# Altium schematic sheet main.SchDoc
size A3; SheetNumber: 1; SheetTotal: 4
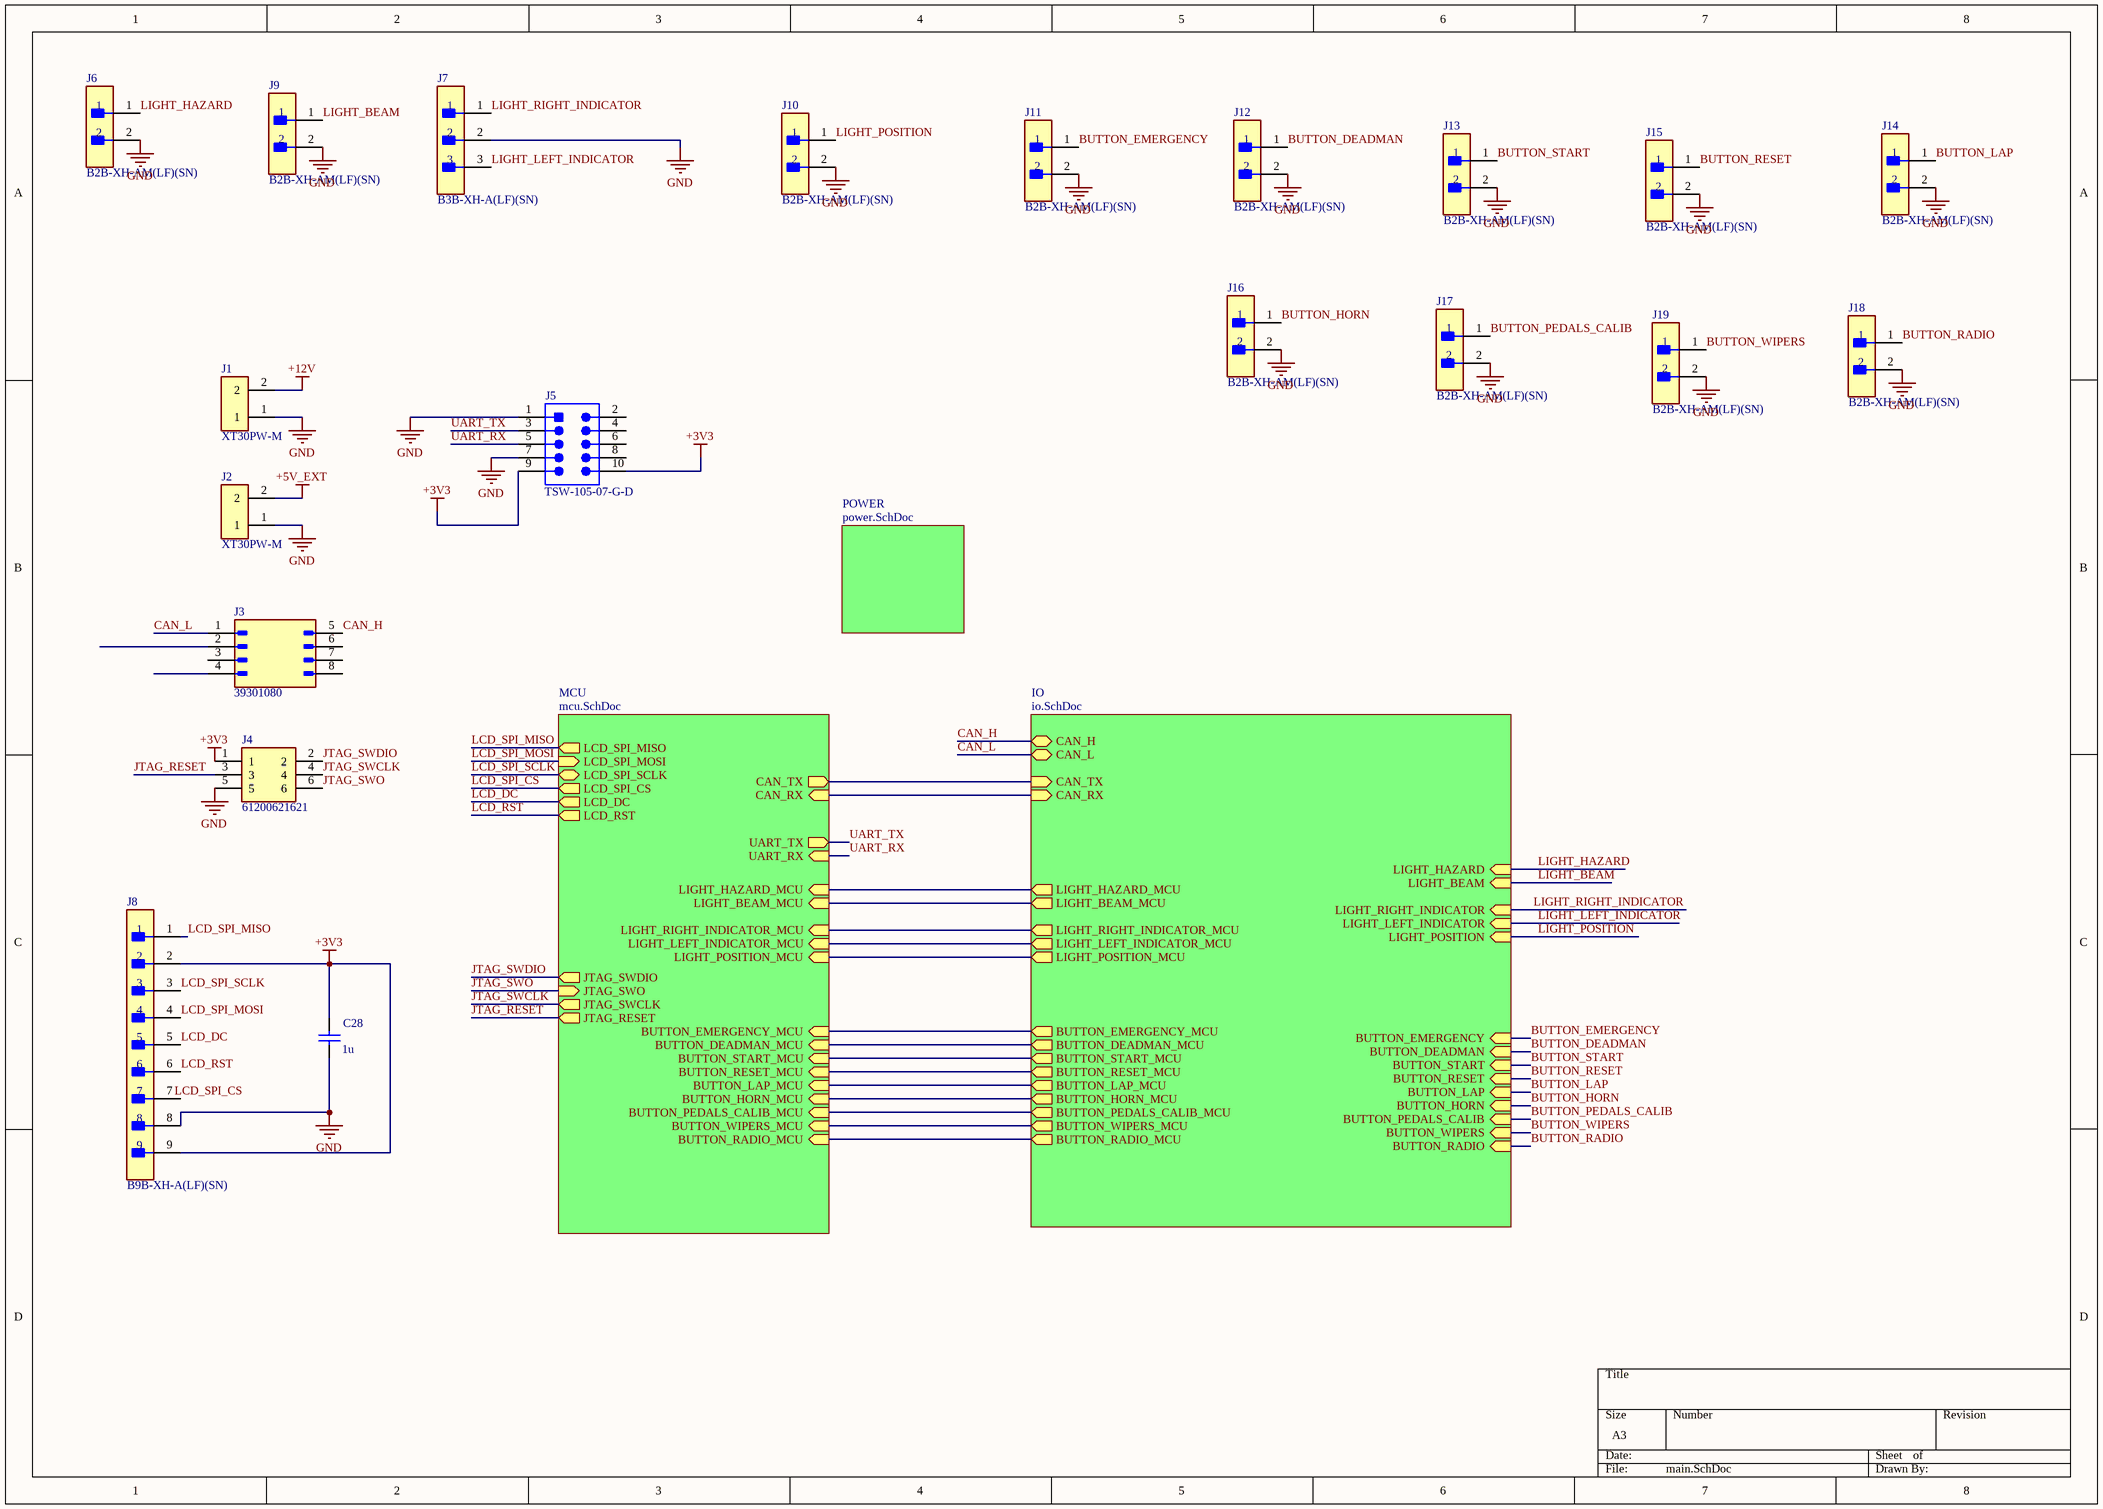
[diagram p0: main.SchDoc]

## Parts
C28  1u  [CAPC1206(3216)150_L]
J1  XT30PW-M  [XT30PWM]
J2  XT30PW-M  [XT30PWM]
J3  39301080  [39301080]
J4  61200621621  [61200621621]
J5  TSW-105-07-G-D  [SMTC-TSW-105-07-G-D_V]
J6  B2B-XH-AM(LF)(SN)  [FP-B2B-XH-AM_LF_SN-MFG]
J7  B3B-XH-A(LF)(SN)  [FP-B3B-XH-A_LF_SN-MFG]
J8  B9B-XH-A(LF)(SN)  [FP-B9B-XH-A_LF_SN-MFG]
J9  B2B-XH-AM(LF)(SN)  [FP-B2B-XH-AM_LF_SN-MFG]
J10  B2B-XH-AM(LF)(SN)  [FP-B2B-XH-AM_LF_SN-MFG]
J11  B2B-XH-AM(LF)(SN)  [FP-B2B-XH-AM_LF_SN-MFG]
J12  B2B-XH-AM(LF)(SN)  [FP-B2B-XH-AM_LF_SN-MFG]
J13  B2B-XH-AM(LF)(SN)  [FP-B2B-XH-AM_LF_SN-MFG]
J14  B2B-XH-AM(LF)(SN)  [FP-B2B-XH-AM_LF_SN-MFG]
J15  B2B-XH-AM(LF)(SN)  [FP-B2B-XH-AM_LF_SN-MFG]
J16  B2B-XH-AM(LF)(SN)  [FP-B2B-XH-AM_LF_SN-MFG]
J17  B2B-XH-AM(LF)(SN)  [FP-B2B-XH-AM_LF_SN-MFG]
J18  B2B-XH-AM(LF)(SN)  [FP-B2B-XH-AM_LF_SN-MFG]
J19  B2B-XH-AM(LF)(SN)  [FP-B2B-XH-AM_LF_SN-MFG]

## Sub-sheets
IO = io.SchDoc: CAN_TX (in), CAN_RX (in), CAN_H (bidir), CAN_L (bidir), LIGHT_HAZARD_MCU (out), LIGHT_BEAM_MCU (out), LIGHT_RIGHT_INDICATOR_MCU (out), LIGHT_LEFT_INDICATOR_MCU (out), LIGHT_POSITION_MCU (out), LIGHT_HAZARD (in), LIGHT_BEAM (in), LIGHT_RIGHT_INDICATOR (in), LIGHT_LEFT_INDICATOR (in), LIGHT_POSITION (in), BUTTON_EMERGENCY_MCU (out), BUTTON_DEADMAN_MCU (out), BUTTON_START_MCU (out), BUTTON_RESET_MCU (out), BUTTON_LAP_MCU (out), BUTTON_HORN_MCU (out), BUTTON_PEDALS_CALIB_MCU (out), BUTTON_WIPERS_MCU (out), BUTTON_RADIO_MCU (out), BUTTON_EMERGENCY (in), BUTTON_DEADMAN (in), BUTTON_START (in), BUTTON_RESET (in), BUTTON_LAP (in), BUTTON_HORN (in), BUTTON_PEDALS_CALIB (in), BUTTON_WIPERS (in), BUTTON_RADIO (in)
MCU = mcu.SchDoc: CAN_TX (out), CAN_RX (in), UART_TX (out), UART_RX (in), JTAG_SWDIO (out), JTAG_SWO (in), JTAG_SWCLK (out), JTAG_RESET (out), LCD_SPI_MISO (out), LCD_SPI_MOSI (in), LCD_SPI_SCLK (bidir), LCD_SPI_CS (out), LCD_DC (out), LCD_RST (out), LIGHT_HAZARD_MCU (in), LIGHT_BEAM_MCU (in), LIGHT_RIGHT_INDICATOR_MCU (in), LIGHT_LEFT_INDICATOR_MCU (in), LIGHT_POSITION_MCU (in), BUTTON_EMERGENCY_MCU (in), BUTTON_DEADMAN_MCU (in), BUTTON_START_MCU (in), BUTTON_RESET_MCU (in), BUTTON_LAP_MCU (in), BUTTON_HORN_MCU (in), BUTTON_PEDALS_CALIB_MCU (in), BUTTON_WIPERS_MCU (in), BUTTON_RADIO_MCU (in)
POWER = power.SchDoc: no entries

## Nets
+3V3: C28.1 J4.1 J5.9 J5.10 J8.2 J8.9
+5V_EXT: J2.2
+12V: J1.2
GND: C28.2 J1.1 J2.1 J4.5 J5.1 J5.7 J6.2 J7.2 J8.8 J9.2 J10.2 J11.2 J12.2 J13.2 J14.2 J15.2 J16.2 J17.2 J18.2 J19.2
BUTTON_DEADMAN: J12.1 ; sheet IO/BUTTON_DEADMAN
BUTTON_EMERGENCY: J11.1 ; sheet IO/BUTTON_EMERGENCY
BUTTON_HORN: J16.1 ; sheet IO/BUTTON_HORN
BUTTON_LAP: J14.1 ; sheet IO/BUTTON_LAP
BUTTON_PEDALS_CALIB: J17.1 ; sheet IO/BUTTON_PEDALS_CALIB
BUTTON_RADIO: J18.1 ; sheet IO/BUTTON_RADIO
BUTTON_RESET: J15.1 ; sheet IO/BUTTON_RESET
BUTTON_START: J13.1 ; sheet IO/BUTTON_START
BUTTON_WIPERS: J19.1 ; sheet IO/BUTTON_WIPERS
CAN_H: J3.5 ; sheet IO/CAN_H
CAN_L: J3.1 ; sheet IO/CAN_L
JTAG_RESET: J4.3 ; sheet MCU/JTAG_RESET
JTAG_SWCLK: J4.4 ; sheet MCU/JTAG_SWCLK
JTAG_SWDIO: J4.2 ; sheet MCU/JTAG_SWDIO
JTAG_SWO: J4.6 ; sheet MCU/JTAG_SWO
LCD_DC: J8.5 ; sheet MCU/LCD_DC
LCD_RST: J8.6 ; sheet MCU/LCD_RST
LCD_SPI_CS: sheet MCU/LCD_SPI_CS
LCD_SPI_MISO: J8.1 ; sheet MCU/LCD_SPI_MISO
LCD_SPI_MOSI: J8.4 ; sheet MCU/LCD_SPI_MOSI
LCD_SPI_SCLK: J8.3 ; sheet MCU/LCD_SPI_SCLK
LIGHT_BEAM: J9.1 ; sheet IO/LIGHT_BEAM
LIGHT_HAZARD: J6.1 ; sheet IO/LIGHT_HAZARD
LIGHT_LEFT_INDICATOR: J7.3 ; sheet IO/LIGHT_LEFT_INDICATOR
LIGHT_POSITION: J10.1 ; sheet IO/LIGHT_POSITION
LIGHT_RIGHT_INDICATOR: J7.1 ; sheet IO/LIGHT_RIGHT_INDICATOR
UART_RX: J5.5 ; sheet MCU/UART_RX
UART_TX: J5.3 ; sheet MCU/UART_TX
(unnamed): sheet MCU/CAN_TX, sheet IO/CAN_TX
(unnamed): sheet MCU/CAN_RX, sheet IO/CAN_RX
(unnamed): sheet MCU/LIGHT_HAZARD_MCU, sheet IO/LIGHT_HAZARD_MCU
(unnamed): sheet MCU/LIGHT_BEAM_MCU, sheet IO/LIGHT_BEAM_MCU
(unnamed): sheet MCU/LIGHT_RIGHT_INDICATOR_MCU, sheet IO/LIGHT_RIGHT_INDICATOR_MCU
(unnamed): sheet MCU/LIGHT_LEFT_INDICATOR_MCU, sheet IO/LIGHT_LEFT_INDICATOR_MCU
(unnamed): sheet MCU/LIGHT_POSITION_MCU, sheet IO/LIGHT_POSITION_MCU
(unnamed): sheet MCU/BUTTON_EMERGENCY_MCU, sheet IO/BUTTON_EMERGENCY_MCU
(unnamed): sheet MCU/BUTTON_DEADMAN_MCU, sheet IO/BUTTON_DEADMAN_MCU
(unnamed): sheet MCU/BUTTON_START_MCU, sheet IO/BUTTON_START_MCU
(unnamed): sheet MCU/BUTTON_RESET_MCU, sheet IO/BUTTON_RESET_MCU
(unnamed): sheet MCU/BUTTON_LAP_MCU, sheet IO/BUTTON_LAP_MCU
(unnamed): sheet MCU/BUTTON_HORN_MCU, sheet IO/BUTTON_HORN_MCU
(unnamed): sheet MCU/BUTTON_PEDALS_CALIB_MCU, sheet IO/BUTTON_PEDALS_CALIB_MCU
(unnamed): sheet MCU/BUTTON_WIPERS_MCU, sheet IO/BUTTON_WIPERS_MCU
(unnamed): sheet MCU/BUTTON_RADIO_MCU, sheet IO/BUTTON_RADIO_MCU

Not connected (* = marked no-connect by the designer): J3 2 3 4 6 7 8; J5 2 4 6 8; J8 7

## Notes on the sheet
- Labels drawn without touching a wire or pin: LCD_SPI_CS

## Library data of the parts
C28 = CMP-1037-04778-1: CAP 1.8uF 10V ±5% 1206 (3216 Metric) Thickness 1.45mm SMD; Case-EIA: 1206; Tolerance: Â±5%; Case-Metric: 3216; Technology: SMT; Value: 1.8uF; Rated Voltage: 10 V; Max Thickness: 1.45 mm
J1 J2 = XT30PW-M: Plug; XT30; Male; 30A; Low Temperature Rise Fire Retardant; Manufacturer_Name: Amass; Geometry.Height: 5mm; Manufacturer_Part_Number: XT30PW-M; Mouser Part Number: *; Mouser Price/Stock: *; Arrow Part Number: *; Arrow Price/Stock: *; Datasheet Link: https://www.tme.eu/sl/Document/ce4077e36b79046da520ca73227e15de/XT30PW%20SPEC.pdf; ComponentLink1URL: https://datasheet.octopart.com/XT30PW-M-Amass-datasheet-165556440.pdf?src-supplier=TME; ComponentLink1Description: https://datasheet.octopart.com/XT30PW-M-Amass-datasheet-165556440.pdf?src-supplier=TME
J3 = 39301080: Connector Wire to Board Header 8 Position 4.2mm Solder Right Angle Thru-Hole Tray; Manufacturer Lifecycle Status: ACTIVE; MF: Molex; Approvals: CSA, TUV, UL; Connector Type: Power, Rectangular; Contact Resistance: 10mΩ; Current Rating: 8A; Gender: Male; Glow Wire Compliant: Non-compliant; Insulation Resistance: 1GΩ; Max Current Rating: 5A; Max Voltage Rating (DC): 250V; Number of Circuits: 6; Number of Contacts: 8; Plating Thickness: 2.54µm; Voltage Rating: 600V; SnapEDA_Link: https://www.snapeda.com/parts/39-30-1080/Molex/view-part/?ref=snap; Package: None; Value: *; MP: 39-30-1080; Check_prices: https://www.snapeda.com/parts/39-30-1080/Molex/view-part/?ref=eda; Supplier: RS; Supplier Part Number: 5109865P; Manufacturer: Molex; Manufacturer Part Number: 39-30-1080; RoHS: Compliant; Category: Headers and Wire Housings; Stock: 1025; China RoHS: Compliant; Color: Natural; Contact Gender: Male; Contact Material: Brass; Contact Plating: Tin; Country of Origin: US; Depth: 5.57mm; ELV: Compliant; Flammability Rating: UL94 V-2; Halogen Free: Low Halogen; Height: 9.9mm; Housing Material: Nylon; Lead Free: Lead Free; Lead Pitch: 4.2mm; Length: 15.65mm; Lifecycle Status: Production; Material: Nylon; Max Operating Temperature: 105°C; Min Operating Temperature: -40°C; Mounting Technology: PCB, Through Hole; Pins: 8; Number of Poles: 8; Number of Positions: 8; Number of Rows: 2; Orientation: Right Angle; Packaging: Bulk; Pitch: 4.2mm; Radiation Hardening: No; REACH SVHC: Yes; Row Spacing: 4.2mm; Schedule B: 8536694040, 8536694040|8536694040|8536694040|8536694040|8536694040; Termination: Solder; Voltage Rating (AC): 600V; Voltage Rating (DC): 600V; Working Voltage: 600V; ComponentLink1URL: https://datasheet.octopart.com:443/39-30-1080-Molex-datasheet-120074128.pdf?src-supplier=IHS; ComponentLink1Description: https://datasheet.octopart.com:443/39-30-1080-Molex-datasheet-120074128.pdf?src-supplier=IHS; ComponentLink2URL: https://datasheet.octopart.com:443/39-30-1080-Molex-datasheet-13785313.pdf?src-supplier=Sager+Electronics; ComponentLink2Description: https://datasheet.octopart.com:443/39-30-1080-Molex-datasheet-13785313.pdf?src-supplier=Sager+Electronics; ComponentLink3URL: https://sigma.octopart.com:443/15644801/technical_drawing/Molex-39-30-1080.pdf?src-supplier=Molex; ComponentLink3Description: https://sigma.octopart.com:443/15644801/technical_drawing/Molex-39-30-1080.pdf?src-supplier=Molex; ComponentLink4URL: https://datasheet.octopart.com:443/39-30-1080-Molex-datasheet-12555477.pdf?src-supplier=Molex; ComponentLink4Description: https://datasheet.octopart.com:443/39-30-1080-Molex-datasheet-12555477.pdf?src-supplier=Molex; ComponentLink5URL: https://datasheet.octopart.com:443/039301080-Molex-datasheet-8338717.pdf?src-supplier=Future+Electronics; ComponentLink5Description: https://datasheet.octopart.com:443/039301080-Molex-datasheet-8338717.pdf?src-supplier=Future+Electronics; ComponentLink6URL: https://datasheet.octopart.com:443/39301080-Molex-datasheet-137316104.pdf?src-supplier=Future+Electronics; ComponentLink6Description: https://datasheet.octopart.com:443/39301080-Molex-datasheet-137316104.pdf?src-supplier=Future+Electronics; ComponentLink7URL: https://datasheet.octopart.com:443/39-30-1080-Molex-datasheet-154749340.pdf?src-supplier=Master+Electronics; ComponentLink7Description: https://datasheet.octopart.com:443/39-30-1080-Molex-datasheet-154749340.pdf?src-supplier=Master+Electronics; ComponentLink8URL: https://datasheet.octopart.com:443/39-30-1080-Molex-datasheet-101582412.pdf?src-supplier=Farnell; ComponentLink8Description: https://datasheet.octopart.com:443/39-30-1080-Molex-datasheet-101582412.pdf?src-supplier=Farnell; ComponentLink9URL: https://datasheet.octopart.com:443/39-30-1080-Molex-datasheet-15687899.pdf?src-supplier=Farnell; ComponentLink9Description: https://datasheet.octopart.com:443/39-30-1080-Molex-datasheet-15687899.pdf?src-supplier=Farnell; ComponentLink10URL: https://datasheet.octopart.com:443/39-30-1080-Molex-datasheet-13550729.pdf?src-supplier=Farnell; ComponentLink10Description: https://datasheet.octopart.com:443/39-30-1080-Molex-datasheet-13550729.pdf?src-supplier=Farnell; ComponentLink11URL: https://datasheet.octopart.com:443/39-30-1080-Molex-datasheet-34223370.pdf?src-supplier=Electro+Sonic; ComponentLink11Description: https://datasheet.octopart.com:443/39-30-1080-Molex-datasheet-34223370.pdf?src-supplier=Electro+Sonic; ComponentLink12URL: https://datasheet.octopart.com:443/39-30-1080-Molex-datasheet-62104202.pdf?src-supplier=Electro+Sonic; ComponentLink12Description: https://datasheet.octopart.com:443/39-30-1080-Molex-datasheet-62104202.pdf?src-supplier=Electro+Sonic; ComponentLink13URL: https://datasheet.octopart.com:443/39-30-1080-Molex-datasheet-23709674.pdf?src-supplier=Electro+Sonic; ComponentLink13Description: https://datasheet.octopart.com:443/39-30-1080-Molex-datasheet-23709674.pdf?src-supplier=Electro+Sonic; ComponentLink14URL: https://datasheet.octopart.com:443/39-30-1080-Molex-datasheet-140183179.pdf?src-supplier=RS+(Formerly+Allied+Electronics); ComponentLink14Description: https://datasheet.octopart.com:443/39-30-1080-Molex-datasheet-140183179.pdf?src-supplier=RS+(Formerly+Allied+Electronics); ComponentLink15URL: https://datasheet.octopart.com:443/39-30-1080-Molex-datasheet-120148733.pdf?src-supplier=RS+(Formerly+Allied+Electronics); ComponentLink15Description: https://datasheet.octopart.com:443/39-30-1080-Molex-datasheet-120148733.pdf?src-supplier=RS+(Formerly+Allied+Electronics); ComponentLink16URL: https://datasheet.octopart.com:443/39-30-1080-Molex-datasheet-34442213.pdf?src-supplier=RS+(Formerly+Allied+Electronics); ComponentLink16Description: https://datasheet.octopart.com:443/39-30-1080-Molex-datasheet-34442213.pdf?src-supplier=RS+(Formerly+Allied+Electronics); ComponentLink17URL: https://datasheet.octopart.com:443/39-30-1080-Molex-datasheet-9783732.pdf?src-supplier=RS+(Formerly+Allied+Electronics); ComponentLink17Description: https://datasheet.octopart.com:443/39-30-1080-Molex-datasheet-9783732.pdf?src-supplier=RS+(Formerly+Allied+Electronics); ComponentLink18URL: https://datasheet.octopart.com:443/39-30-1080-Molex-datasheet-72655.pdf?src-supplier=RS+(Formerly+Allied+Electronics); ComponentLink18Description: https://datasheet.octopart.com:443/39-30-1080-Molex-datasheet-72655.pdf?src-supplier=RS+(Formerly+Allied+Electronics); ComponentLink19URL: https://datasheet.octopart.com:443/39-30-1080-Molex-datasheet-156091078.pdf?src-supplier=Jameco; ComponentLink19Description: https://datasheet.octopart.com:443/39-30-1080-Molex-datasheet-156091078.pdf?src-supplier=Jameco; ComponentLink20URL: https://datasheet.octopart.com:443/39301080-Molex-datasheet-8197183.pdf?src-supplier=Jameco; ComponentLink20Description: https://datasheet.octopart.com:443/39301080-Molex-datasheet-8197183.pdf?src-supplier=Jameco; ComponentLink21URL: https://datasheet.octopart.com:443/39-30-1080-Molex-datasheet-7269772.pdf?src-supplier=Jameco; ComponentLink21Description: https://datasheet.octopart.com:443/39-30-1080-Molex-datasheet-7269772.pdf?src-supplier=Jameco; ComponentLink22URL: https://datasheet.octopart.com:443/39-30-1080-Molex-datasheet-33002877.pdf?src-supplier=Newark; ComponentLink22Description: https://datasheet.octopart.com:443/39-30-1080-Molex-datasheet-33002877.pdf?src-supplier=Newark; ComponentLink23URL: https://datasheet.octopart.com:443/39-30-1080-Molex-datasheet-21207490.pdf?src-supplier=Newark; ComponentLink23Description: https://datasheet.octopart.com:443/39-30-1080-Molex-datasheet-21207490.pdf?src-supplier=Newark; ComponentLink24URL: https://datasheet.octopart.com:443/39-30-1080-Molex-datasheet-2405.pdf?src-supplier=Newark; ComponentLink24Description: https://datasheet.octopart.com:443/39-30-1080-Molex-datasheet-2405.pdf?src-supplier=Newark; ComponentLink25URL: https://datasheet.octopart.com:443/39-30-1080-Molex-datasheet-21395541.pdf?src-supplier=TME; ComponentLink25Description: https://datasheet.octopart.com:443/39-30-1080-Molex-datasheet-21395541.pdf?src-supplier=TME; ComponentLink26URL: https://datasheet.octopart.com:443/39-30-1080-Molex-datasheet-8361750.pdf?src-supplier=Verical; ComponentLink26Description: https://datasheet.octopart.com:443/39-30-1080-Molex-datasheet-8361750.pdf?src-supplier=Verical; ComponentLink27URL: https://datasheet.octopart.com:443/39-30-1080-Molex-datasheet-145504.pdf?src-supplier=DigiKey; ComponentLink27Description: https://datasheet.octopart.com:443/39-30-1080-Molex-datasheet-145504.pdf?src-supplier=DigiKey; ComponentLink28URL: http://sigma.octopart.com:80/15645381/rohs_certificate/Molex-39-30-1080.pdf?src-supplier=Compliance+Statements; ComponentLink28Description: http://sigma.octopart.com:80/15645381/rohs_certificate/Molex-39-30-1080.pdf?src-supplier=Compliance+Statements; ComponentLink29URL: http://sigma.octopart.com:80/conflict_mineral_statement/Molex-company-72.pdf?src-supplier=Compliance+Statements; ComponentLink29Description: http://sigma.octopart.com:80/conflict_mineral_statement/Molex-company-72.pdf?src-supplier=Compliance+Statements; ComponentLink30URL: http://sigma.octopart.com:80/rohs_statement/Molex-company-73.pdf?src-supplier=Compliance+Statements; ComponentLink30Description: http://sigma.octopart.com:80/rohs_statement/Molex-company-73.pdf?src-supplier=Compliance+Statements; ComponentLink31URL: http://sigma.octopart.com:80/reach_statement/Molex-company-74.pdf?src-supplier=Compliance+Statements; ComponentLink31Description: http://sigma.octopart.com:80/reach_statement/Molex-company-74.pdf?src-supplier=Compliance+Statements
J4 = 61200621621: Conn Shrouded Header (4 Sides) M 6 POS 2.54mm Solder ST Top Entry Thru-Hole Tray; Manufacturer_Name: Wurth Elektronik; Geometry.Height: 9.1mm; Connector Type: Male Pin; Contact Resistance: 20mΩ; Current Rating: 3A; Gender: Male; Insulation Resistance: 1GΩ; Number of Contacts: 6; Operating Supply Voltage: 250V; Manufacturer_Part_Number: 61200621621; Mouser Part Number: 710-61200621621; Mouser Price/Stock: https://www.mouser.co.uk/ProductDetail/Wurth-Elektronik/61200621621?qs=PhR8RmCirEbjX8n1RKw4Jw%3D%3D; Arrow Part Number: *; Arrow Price/Stock: *; Datasheet Link: https://katalog.we-online.de/em/datasheet/6120xx21621.pdf; Supplier: RS; Supplier Part Number: 8236430; Manufacturer: Wurth Elektronik; Manufacturer Part Number: 61200621621; RoHS: Compliant; Category: Headers and Wire Housings; Stock: 450; Color: Black; Contact Material: Copper; Contact Plating: Gold; Insulation Material: PBT; Lead Pitch: 2.54mm; Length: 15.28mm; Max Operating Temperature: 105°C; Min Operating Temperature: -40°C; Mounting Technology: Through Hole; Pins: 6; Number of Positions: 6; Number of Rows: 2; Orientation: Vertical; Pitch: 2.54mm; Row Spacing: 2.54mm; Termination: Solder; ComponentLink1URL: https://datasheet.octopart.com:443/61200621621-Wurth-Elektronik-datasheet-168479915.pdf?src-supplier=Newark; ComponentLink1Description: https://datasheet.octopart.com:443/61200621621-Wurth-Elektronik-datasheet-168479915.pdf?src-supplier=Newark; ComponentLink2URL: https://datasheet.octopart.com:443/61200621621-W%C3%BCrth-Elektronik-datasheet-5367532.pdf?src-supplier=Newark; ComponentLink2Description: https://datasheet.octopart.com:443/61200621621-W%C3%BCrth-Elektronik-datasheet-5367532.pdf?src-supplier=Newark; ComponentLink3URL: https://datasheet.octopart.com:443/61200621621-W%C3%BCrth-Elektronik-datasheet-62127819.pdf?src-supplier=Upverter; ComponentLink3Description: https://datasheet.octopart.com:443/61200621621-W%C3%BCrth-Elektronik-datasheet-62127819.pdf?src-supplier=Upverter; ComponentLink4URL: https://datasheet.octopart.com:443/61200621621-W%C3%BCrth-Elektronik-datasheet-111087935.pdf?src-supplier=Wurth+Elektronik; ComponentLink4Description: https://datasheet.octopart.com:443/61200621621-W%C3%BCrth-Elektronik-datasheet-111087935.pdf?src-supplier=Wurth+Elektronik; ComponentLink5URL: https://datasheet.octopart.com:443/61200621621-W%C3%BCrth-Elektronik-datasheet-149523874.pdf?src-supplier=Farnell; ComponentLink5Description: https://datasheet.octopart.com:443/61200621621-W%C3%BCrth-Elektronik-datasheet-149523874.pdf?src-supplier=Farnell
J5 = CMP-2000-07330-1: Post Terminal Strip Assembly, Pitch 2.54 mm, 2 x 5 Position, Height 8.58 mm, Tail Length 2.54 mm, -55 to 125 degC, RoHS, Bulk; Manufacturer: Samtec-Inc.; Connector Type: Header,Unshrouded; Number of Positions Loaded: All; Pitch: 0.100"(2.54mm); Number of Positions: 10; Package Reference: TSW-105-07-G-D; Mounting Technology: ThroughHole; Datasheet URL: http://suddendocs.samtec.com/prints/tsw-xxx-xx-xxx-x-xx-xxx-mkt.pdf; Termination: Solder; Packaging: Bulk; Number of Rows: 2; Contact Finish: Gold; Mounting Type: ThroughHole; Features: -; Color: Black; Category: Connectors,Interconnects; Family: RectangularConnectors-Headers,MalePins; Manufacturer URL: http://www.samtec.com/; Series: TSW; Fastening Type: -; Package URL: http://suddendocs.samtec.com/prints/tsw-xxx-xx-x-x-xx-xxx-footprint.pdf; Row Spacing: 0.100"(2.54mm); Contact Mating Length: 0.230"(5.84mm); Contact Finish Thickness: 10µin(0.25µm); Contact Type: MalePin; Package Description: Male Header, Pitch 2.54 mm, 2 x 5 Position, Height 8.58 mm, Tail Length 2.54 mm; Datasheet Version: Rev. DO, 08/1988
J6 J9-J19 = CMP-17439-000037-1: CONN HEADER VERT 2POS 2.5MM; Max Voltage Rating (AC): 250V; Connector Type: Male Pin; Contact Resistance: 20mR; Max Current Rating: 3A; Number of Positions: 2; Series: XH; Contact Material: Brass; Mount: Through Hole; Housing Material: Polyamide; Contact Plating: Tin; Termination: Solder; Max Operating Temperature: 85°C; Depth: 5.75mm; Packaging: Bulk; Min Operating Temperature: -25°C; Contact Type: Male Pin; Color: Green; Pitch: 2.5mm; Length: 7.4mm; Lead Free: Lead Free; Number of Rows: 1; Fastening Type: Detent; Housing Color: White; Orientation: Straight
J7 = CMP-17439-000014-3: CONN HEADER VERT 3POS 2.5MM; Max Voltage Rating (DC): 250V; Number of Positions: 3; Current Rating: 3A; Gender: Male; Wire/Cable Gauge: 22AWG; Contact Resistance: 20mR; Insulation Resistance: 1GR; Insulation Material: Nylon; Contact Plating: Tin; Depth: 5.75mm; Contact Type: Male Pin; Max Operating Temperature: 85°C; Insulation Color: Natural; Voltage Rating (AC): 250V; Color: Natural; Connector Type: Header; Orientation: Straight; Fastening Type: Detent; Housing Color: White; Min Operating Temperature: -25°C; Termination: Solder; Voltage Rating: 250V; Series: XH; Pitch: 2.5mm; Contact Shape: Square; Number of Rows: 1; Lead Free: Lead Free; Packaging: Bulk; Mount: Through Hole; Flammability Rating: UL94 V-0; Max Voltage Rating (AC): 250V; REACH SVHC: No SVHC; Housing Material: Polyamide; Contact Material: Brass; Lead Pitch: 2.5mm; Contact Finish - Mating: TIN; Length: 9.9mm; Max Current Rating: 3A; Number of Contacts: 3
J8 = CMP-17439-000168-1: CONN HEADER VERT 9POS 2.5MM; Wire/Cable Gauge: 22AWG; Current Rating: 3A; Insulation Resistance: 1GR; Mated Stacking Heights: 9.8mm; Max Voltage Rating (AC): 250V; Contact Resistance: 20mR; Gender: Male; Number of Contacts: 9; Orientation: Straight; Contact Finish - Mating: TIN; Number of Rows: 1; Max Operating Temperature: 85°C; Contact Plating: Tin; Flammability Rating: UL94 V-0; Length: 24.9mm; REACH SVHC: No SVHC; Depth: 5.75mm; Housing Color: White; Package Quantity: 250; Lead Pitch: 2.5mm; Connector Type: Header; Voltage Rating (AC): 250V; Packaging: Bulk; Color: Natural; Min Operating Temperature: -25°C; Insulation Color: Natural; Insulation Material: Nylon; Voltage Rating: 250V; Pitch: 2.5mm; Lead Free: Lead Free; Contact Shape: Square; Housing Material: Polyamide; Series: XH; Termination: Solder; Contact Type: Male Pin; Mount: Through Hole; Max Current Rating: 3A; Number of Positions: 9; Contact Material: Brass; Fastening Type: Detent